# EAGLE schematic vn808cm_bo (EAGLE 6.5.0)
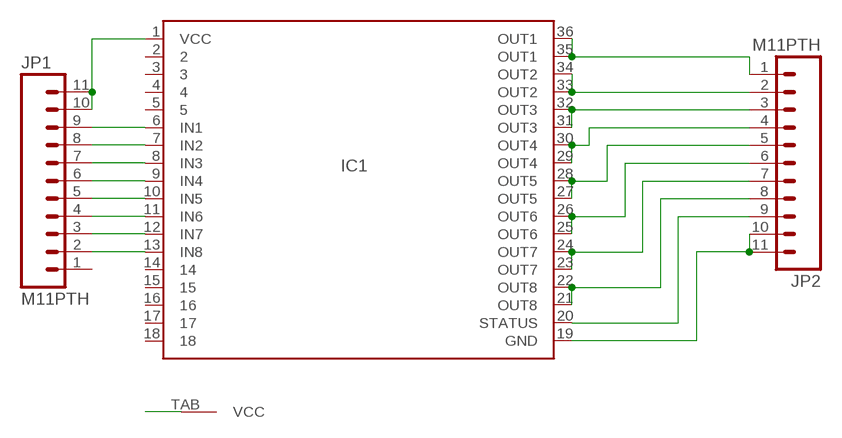
[diagram p0: schematic, sheet 1]

## Parts
IC1  VN808CM-E  [POWERSO-36]
JP1  M11PTH  [1X11]
JP2  M11PTH  [1X11]

## Nets
GND: IC1.19(GND) JP2.10 JP2.11
IN1: IC1.6(IN1) JP1.9
IN2: IC1.7(IN2) JP1.8
IN3: IC1.8(IN3) JP1.7
IN4: IC1.9(IN4) JP1.6
IN5: IC1.10(IN5) JP1.5
IN6: IC1.11(IN6) JP1.4
IN7: IC1.12(IN7) JP1.3
IN8: IC1.13(IN8) JP1.2
OUT1: IC1.35(OUT1) IC1.36(OUT1) JP2.1
OUT2: IC1.33(OUT2) IC1.34(OUT2) JP2.2
OUT3: IC1.31(OUT3) IC1.32(OUT3) JP2.3
OUT4: IC1.29(OUT4) IC1.30(OUT4) JP2.4
OUT5: IC1.27(OUT5) IC1.28(OUT5) JP2.5
OUT6: IC1.25(OUT6) IC1.26(OUT6) JP2.6
OUT7: IC1.23(OUT7) IC1.24(OUT7) JP2.7
OUT8: IC1.21(OUT8) IC1.22(OUT8) JP2.8
STATUS: IC1.20(STATUS) JP2.9
VCC: IC1.1(VCC) IC1.TAB(VCC) JP1.10 JP1.11
Unconnected: IC1.2 IC1.3 IC1.4 IC1.5 IC1.14 IC1.15 IC1.16 IC1.17 IC1.18 JP1.1

## Library data of the parts
IC1 = vn808cm:VN808CM-E: edit this description Auto generated by make-symbol-device-package-bsdl.ulp Rev. 43 Source:
JP1 JP2 = SparkFun-Connectors:M11: Header 11 Standard 11-pin 0.1" header. Use with straight break away headers (SKU : PRT-00116), right angle break away headers (PRT-00553), swiss pins (PRT-00743), machine pins (PRT-00117), and female headers (PRT-00115).